# EAGLE design servo-ldr (EAGLE 9.4.2)
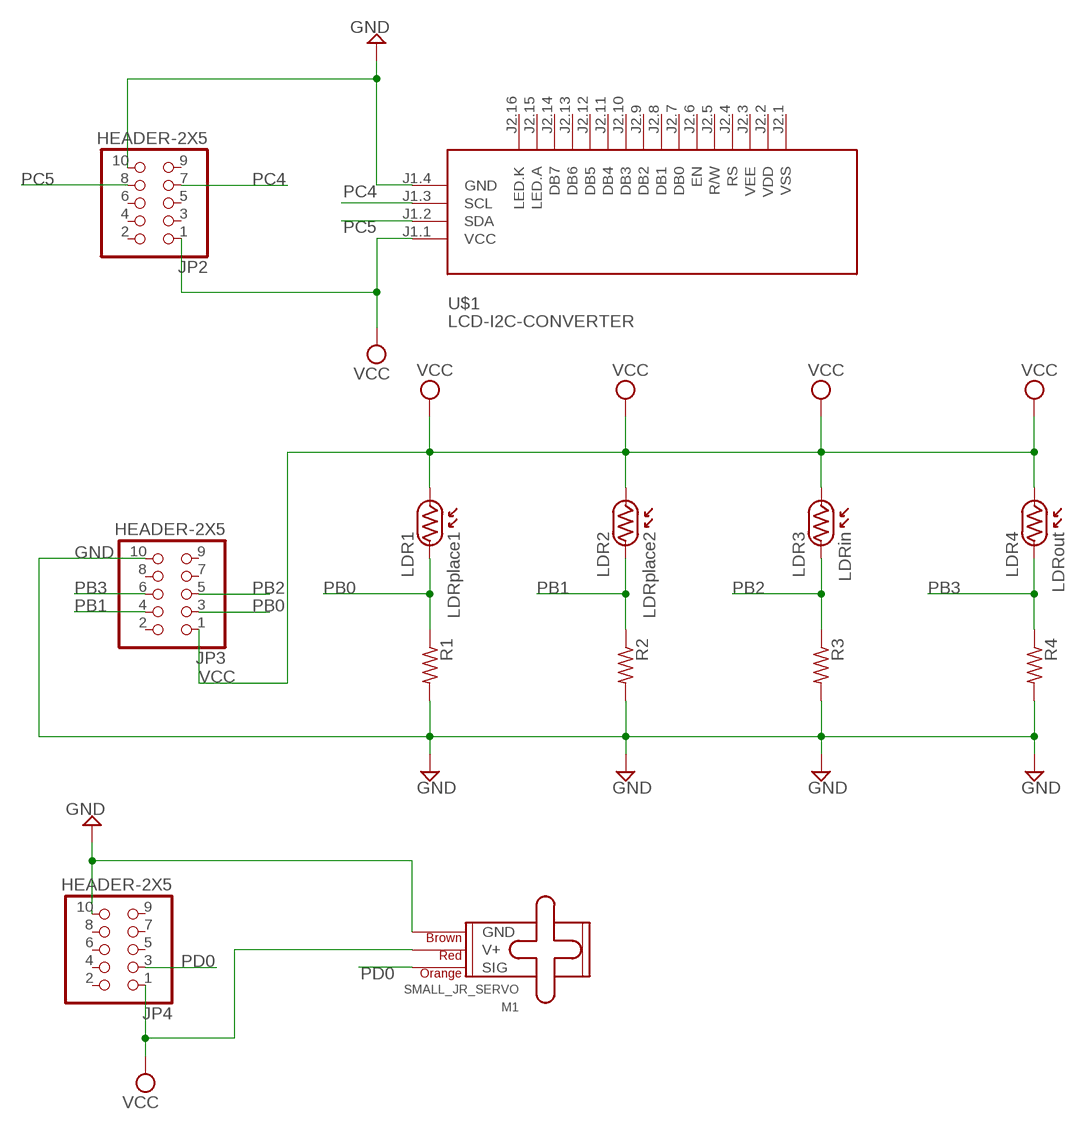
[diagram p0: schematic, sheet 1]

## Parts
JP2  HEADER-2X5  [2X05]
JP3  HEADER-2X5  [2X05]
JP4  HEADER-2X5  [2X05]
LDR1  LDRplace1  LDR  [3MM]
LDR2  LDRplace2  LDR  [3MM]
LDR3  LDRin  LDR  [3MM]
LDR4  LDRout  LDR  [3MM]
M1  SMALL_JR_SERVO  [1X03]
R1  R-US_0207/10  [0207/10]
R2  R-US_0207/10  [0207/10]
R3  R-US_0207/10  [0207/10]
R4  R-US_0207/10  [0207/10]
U$1  LCD-I2C-CONVERTER  [LCD-I2C-CONVERTER]

## Nets
GND: JP2.10 JP3.10 JP4.10 M1.3(GND) R1.2 R2.2 R3.2 R4.2 U$1.J1.4(GND)
PB0: JP3.3 LDR1.P$2 R1.1
PB1: JP3.4 LDR2.P$2 R2.1
PB2: JP3.5 LDR3.P$2 R3.1
PB3: JP3.6 LDR4.P$2 R4.1
PC4: JP2.7 U$1.J1.3(SCL)
PC5: JP2.8 U$1.J1.2(SDA)
PD0: JP4.3 M1.1(SIG)
VCC: JP2.1 JP3.1 JP4.1 LDR1.P$1 LDR2.P$1 LDR3.P$1 LDR4.P$1 M1.2(V+) U$1.J1.1(VCC)
Unconnected: JP2.2 JP2.3 JP2.4 JP2.5 JP2.6 JP2.9 JP3.2 JP3.7 JP3.8 JP3.9 JP4.2 JP4.4 JP4.5 JP4.6 JP4.7 JP4.8 JP4.9 U$1.J2.1(VSS) U$1.J2.2(VDD) U$1.J2.3(VEE) U$1.J2.4(RS) U$1.J2.5(R/W) U$1.J2.6(EN) U$1.J2.7(DB0) U$1.J2.8(DB1) U$1.J2.9(DB2) U$1.J2.10(DB3) U$1.J2.11(DB4) U$1.J2.12(DB5) U$1.J2.13(DB6) U$1.J2.14(DB7) U$1.J2.15(LED.A) U$1.J2.16(LED.K)

## Library data of the parts
JP2-JP4 = practicum:HEADER-2X5: 2x5 PIN HEADER Obtained from http://www.microbuilder.eu/Projects/EagleFootprintLibrary.aspx
LDR1-LDR4 = practicum:LDR: Light-Dependent Resister (LDR) Designed by Chaiporn Jaikaeo
M1 = cmuphyscomp:SMALL_JR_SERVO: Small servo motor This is the small servo used in the SIK. SKU: ROB-09065
R1-R4 = rcl:R-US_: RESISTOR, American symbol; SPICEPREFIX: R
U$1 = diy-modules:LCD-I2C-CONVERTER: I2C Bus to 4-Bit Parallel LCD Interface with LED backlight driver

## Board
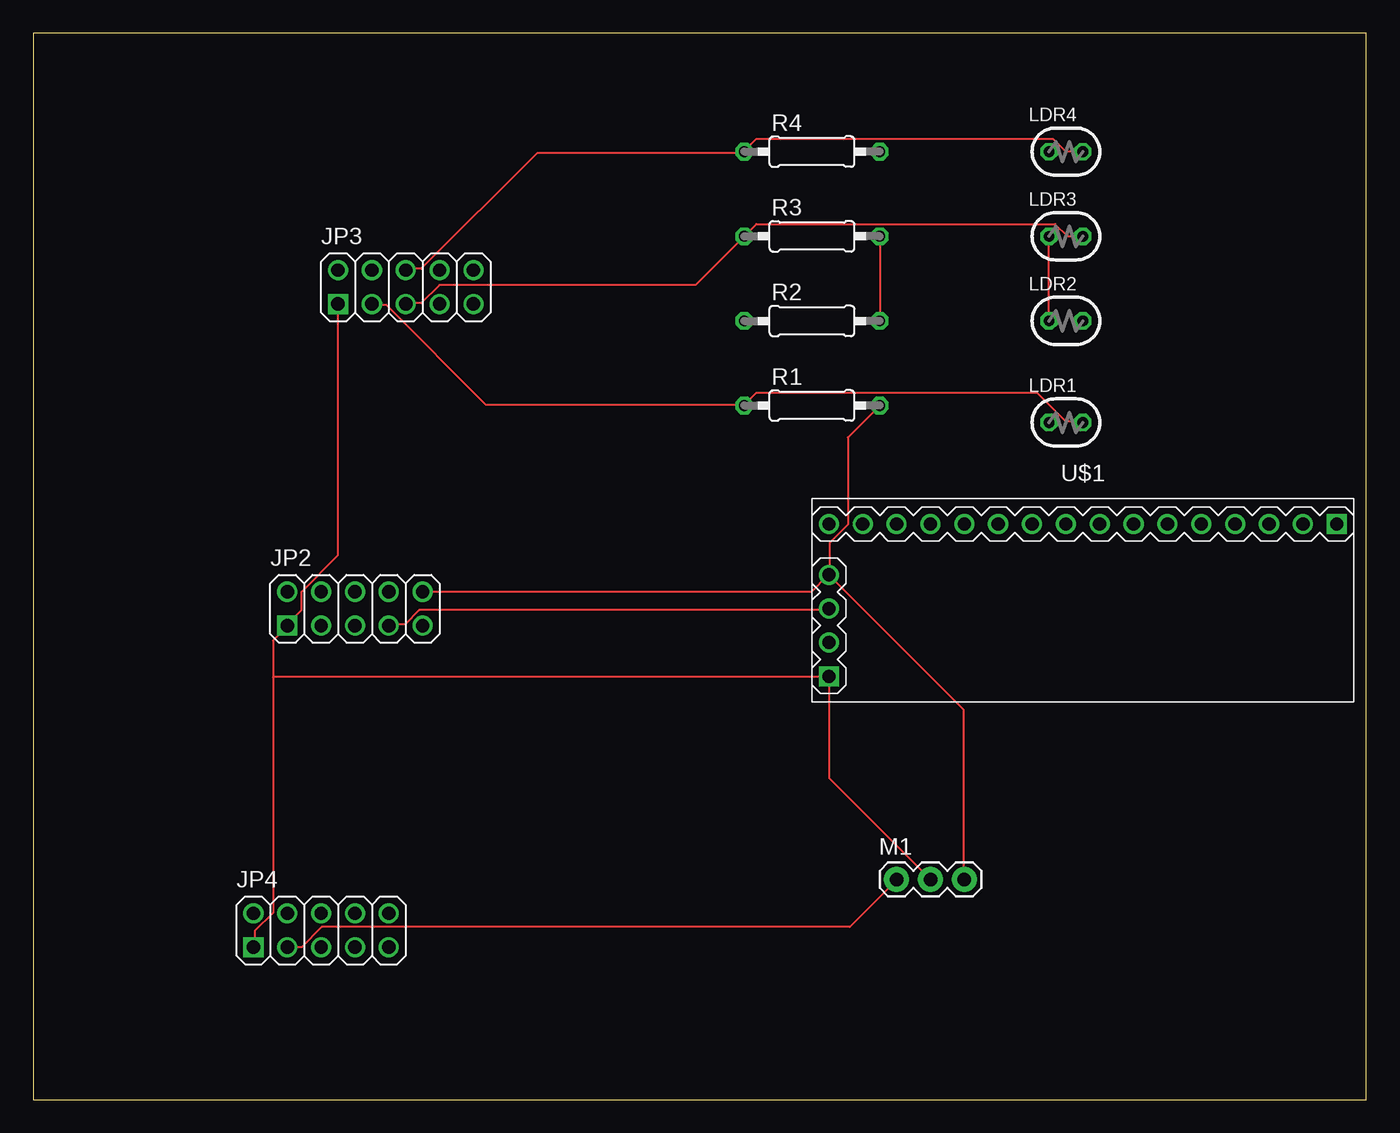
[diagram p1: board, top side]
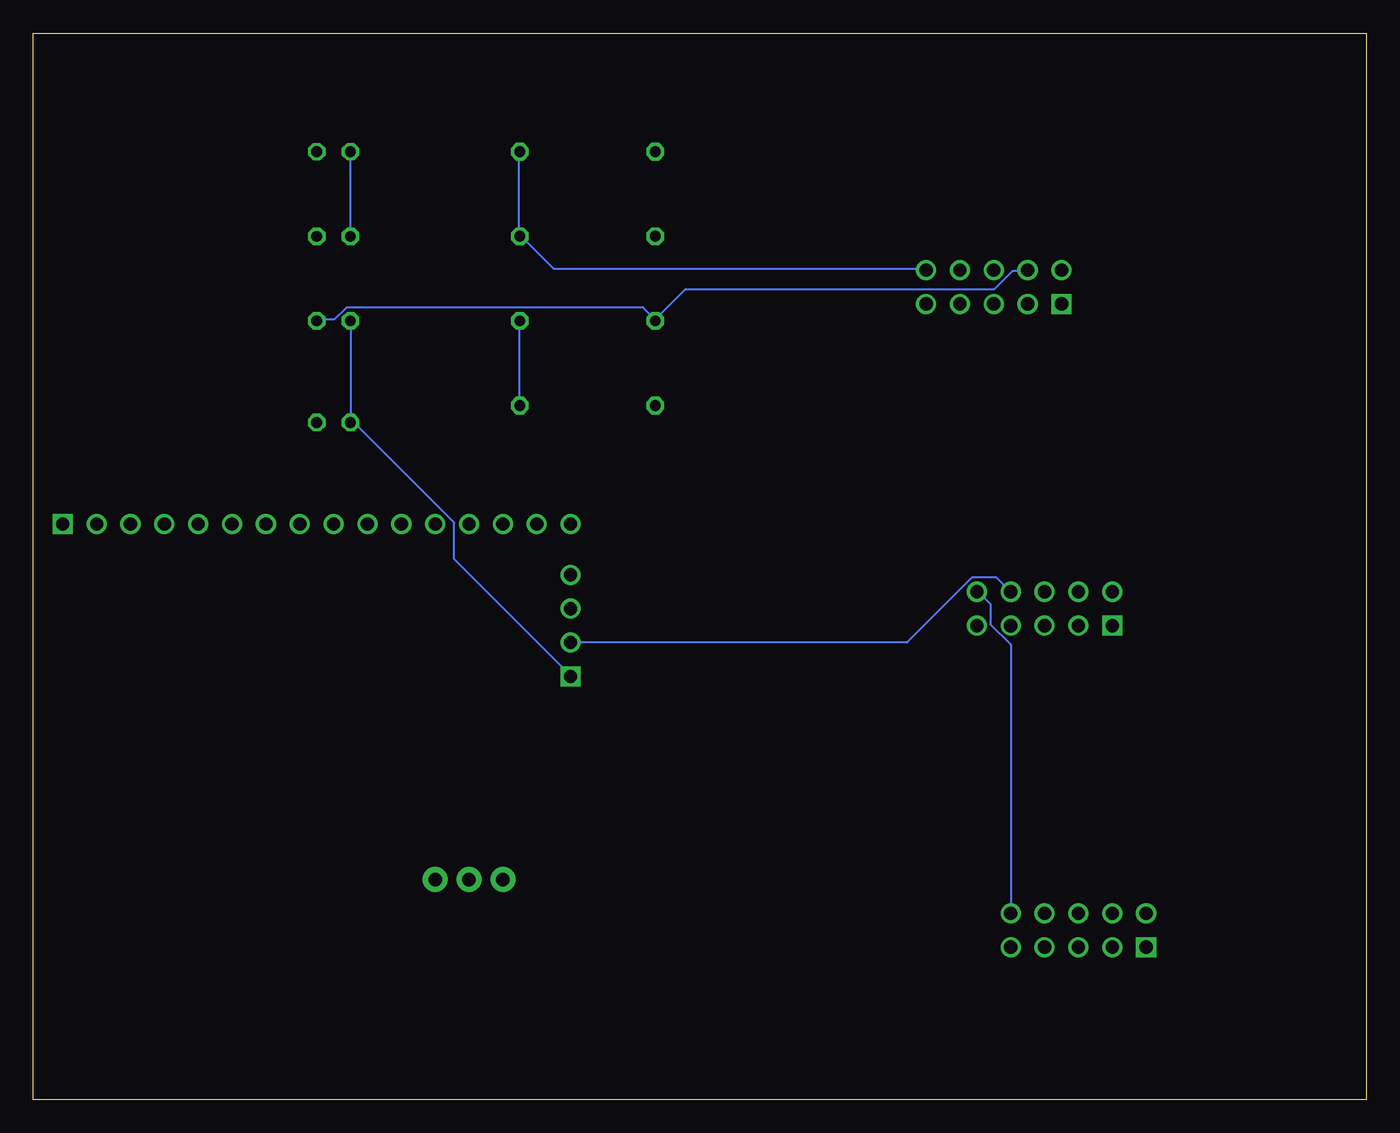
[diagram p2: board, bottom side, seen from below]

Size 100 x 80 mm. Coordinates in mm from the lower left corner, seen from the top.
Outline: 0,0 100,0 100,80 0,80 0,0
Copper layers (1*16): Top 0.035mm / dielectric 1.5mm / Bottom 0.035mm
Design rules "default": minimum track width 6mil, minimum drill 0.35mm, track to track 6mil, track to pad 6mil, pad to pad 6mil, via to via 6mil, smd to smd 6mil, copper to edge 40mil, drill to drill 6mil, minimum pad ring 10mil, minimum via ring 8mil, stop-mask expansion 4mil, vias tented up to drill 0mil, thermal gap 10mil

### Footprints (pad centres in the part's own frame; a part is rotated, then mirrored left to right if it is on the bottom)
2X05 = drill 1 square: 1 -5.08,-1.27 | drill 1: 2 -5.08,1.27; 3 -2.54,-1.27; 4 -2.54,1.27; 5 0,-1.27; 6 0,1.27; 7 2.54,-1.27; 8 2.54,1.27; 9 5.08,-1.27; 10 5.08,1.27
3MM = drill 0.8 octagon: P$1 0,0; P$2 2.54,0
1X03 = drill 1.016 pad 1.88: 1 0,0; 2 2.54,0; 3 5.08,0
0207/10 = drill 0.813 octagon: 1 -5.08,0; 2 5.08,0
LCD-I2C-CONVERTER = drill 1 square: J1.1 -19.05,-5.08; J2.1 19.05,6.35 | drill 1: J1.2 -19.05,-2.54; J1.3 -19.05,0; J1.4 -19.05,2.54; J2.2 16.51,6.35; J2.3 13.97,6.35; J2.4 11.43,6.35; J2.5 8.89,6.35; J2.6 6.35,6.35; J2.7 3.81,6.35; J2.8 1.27,6.35; J2.9 -1.27,6.35; J2.10 -3.81,6.35; J2.11 -6.35,6.35; J2.12 -8.89,6.35; J2.13 -11.43,6.35; J2.14 -13.97,6.35; J2.15 -16.51,6.35; J2.16 -19.05,6.35

### Placement (x,y rotation side)
JP2  24.13,36.83 0 top
JP3  27.94,60.96 0 top
JP4  21.59,12.7 0 top
LDR1  76.2,50.8 0 top
LDR2  76.2,58.42 0 top
LDR3  76.2,64.77 0 top
LDR4  76.2,71.12 0 top
M1  64.77,16.51 0 top
R1  58.42,52.07 0 top
R2  58.42,58.42 0 top
R3  58.42,64.77 0 top
R4  58.42,71.12 0 top
U$1  78.74,36.83 0 top

### Tracks (layer width: path | path; a pad name or v marks a point on that pad's centre or on a via)
GND
  Top 0.152: R3.2 63.55,64.77 63.55,58.52 R2.2 | R1.2 61.11,49.68 61.11,43.13 59.74,41.76 59.74,39.47 U$1.J1.4 | U$1.J1.4 69.8,29.26 69.8,16.61 M1.3 | JP2.10 58.37,38.1 59.59,39.32 U$1.J1.4
  Bottom 0.152: JP4.10 26.67,34.14 28.19,35.66 28.19,37.19 29.11,38.1 JP2.10 | R1.2 63.55,52.12 63.55,58.37 R2.2 | R4.2 63.55,71.02 63.55,64.77 R3.2 63.4,64.77 60.96,62.33 33.07,62.33 JP3.10
PB0
  Top 0.152: 53.34,52.12 54.25,53.03 75.29,53.03 77.42,50.9 78.64,50.9 LDR1.P$2 | 53.34,52.12 33.98,52.12 26.52,59.59 25.45,59.59 JP3.3 | 53.34,52.12 R1.1
PB1
  Bottom 0.152: 53.34,58.52 54.25,59.44 76.5,59.44 77.42,58.52 78.64,58.52 LDR2.P$2 | 53.34,58.52 51.05,60.81 27.89,60.81 26.52,62.18 25.45,62.18 JP3.4 | 53.34,58.52 R2.1
PB2
  Top 0.152: LDR3.P$2 77.57,64.77 76.66,65.68 54.25,65.68 R3.1 49.68,61.11 30.48,61.11 29.11,59.74 28.04,59.74 JP3.5
PB3
  Top 0.152: LDR4.P$2 78.64,71.17 77.42,71.17 76.5,72.08 54.25,72.08 53.34,71.17 R4.1 53.34,71.02 37.8,71.02 29.11,62.33 28.04,62.33 JP3.6
PC4
  Top 0.152: JP2.7 26.67,35.66 27.89,35.66 28.96,36.73 59.59,36.73 U$1.J1.3
PC5
  Bottom 0.152: U$1.J1.2 34.44,34.29 29.57,39.17 27.74,39.17 JP2.8
PD0
  Top 0.152: JP4.3 20.12,11.43 21.64,12.95 61.27,12.95 64.77,16.46 M1.1
VCC
  Top 0.152: 17.98,31.7 17.98,34.44 19.05,35.51 JP2.1 19.05,35.66 20.12,36.73 20.12,38.1 22.86,40.84 JP3.1 | 17.98,31.7 17.98,14.02 16.61,12.65 16.61,11.43 JP4.1 | LDR2.P$1 LDR3.P$1 | M1.2 59.74,24.08 59.74,31.7 U$1.J1.1 59.59,31.7 17.98,31.7
  Bottom 0.152: LDR2.P$1 LDR1.P$1 76.2,50.75 75.89,50.75 68.43,43.28 68.43,40.54 59.74,31.85 U$1.J1.1 | LDR3.P$1 LDR4.P$1